# Altium schematic sheet TopLevel.SchDoc: =project_title
size Tabloid; CompanyName: Luxonis Holding; Organization: Luxonis Holding; Address1: 1925 Harmony Park Drive; Address2: Westminster, CO; Address3: 80234; Address4: United States; SheetNumber: 1; SheetTotal: 13
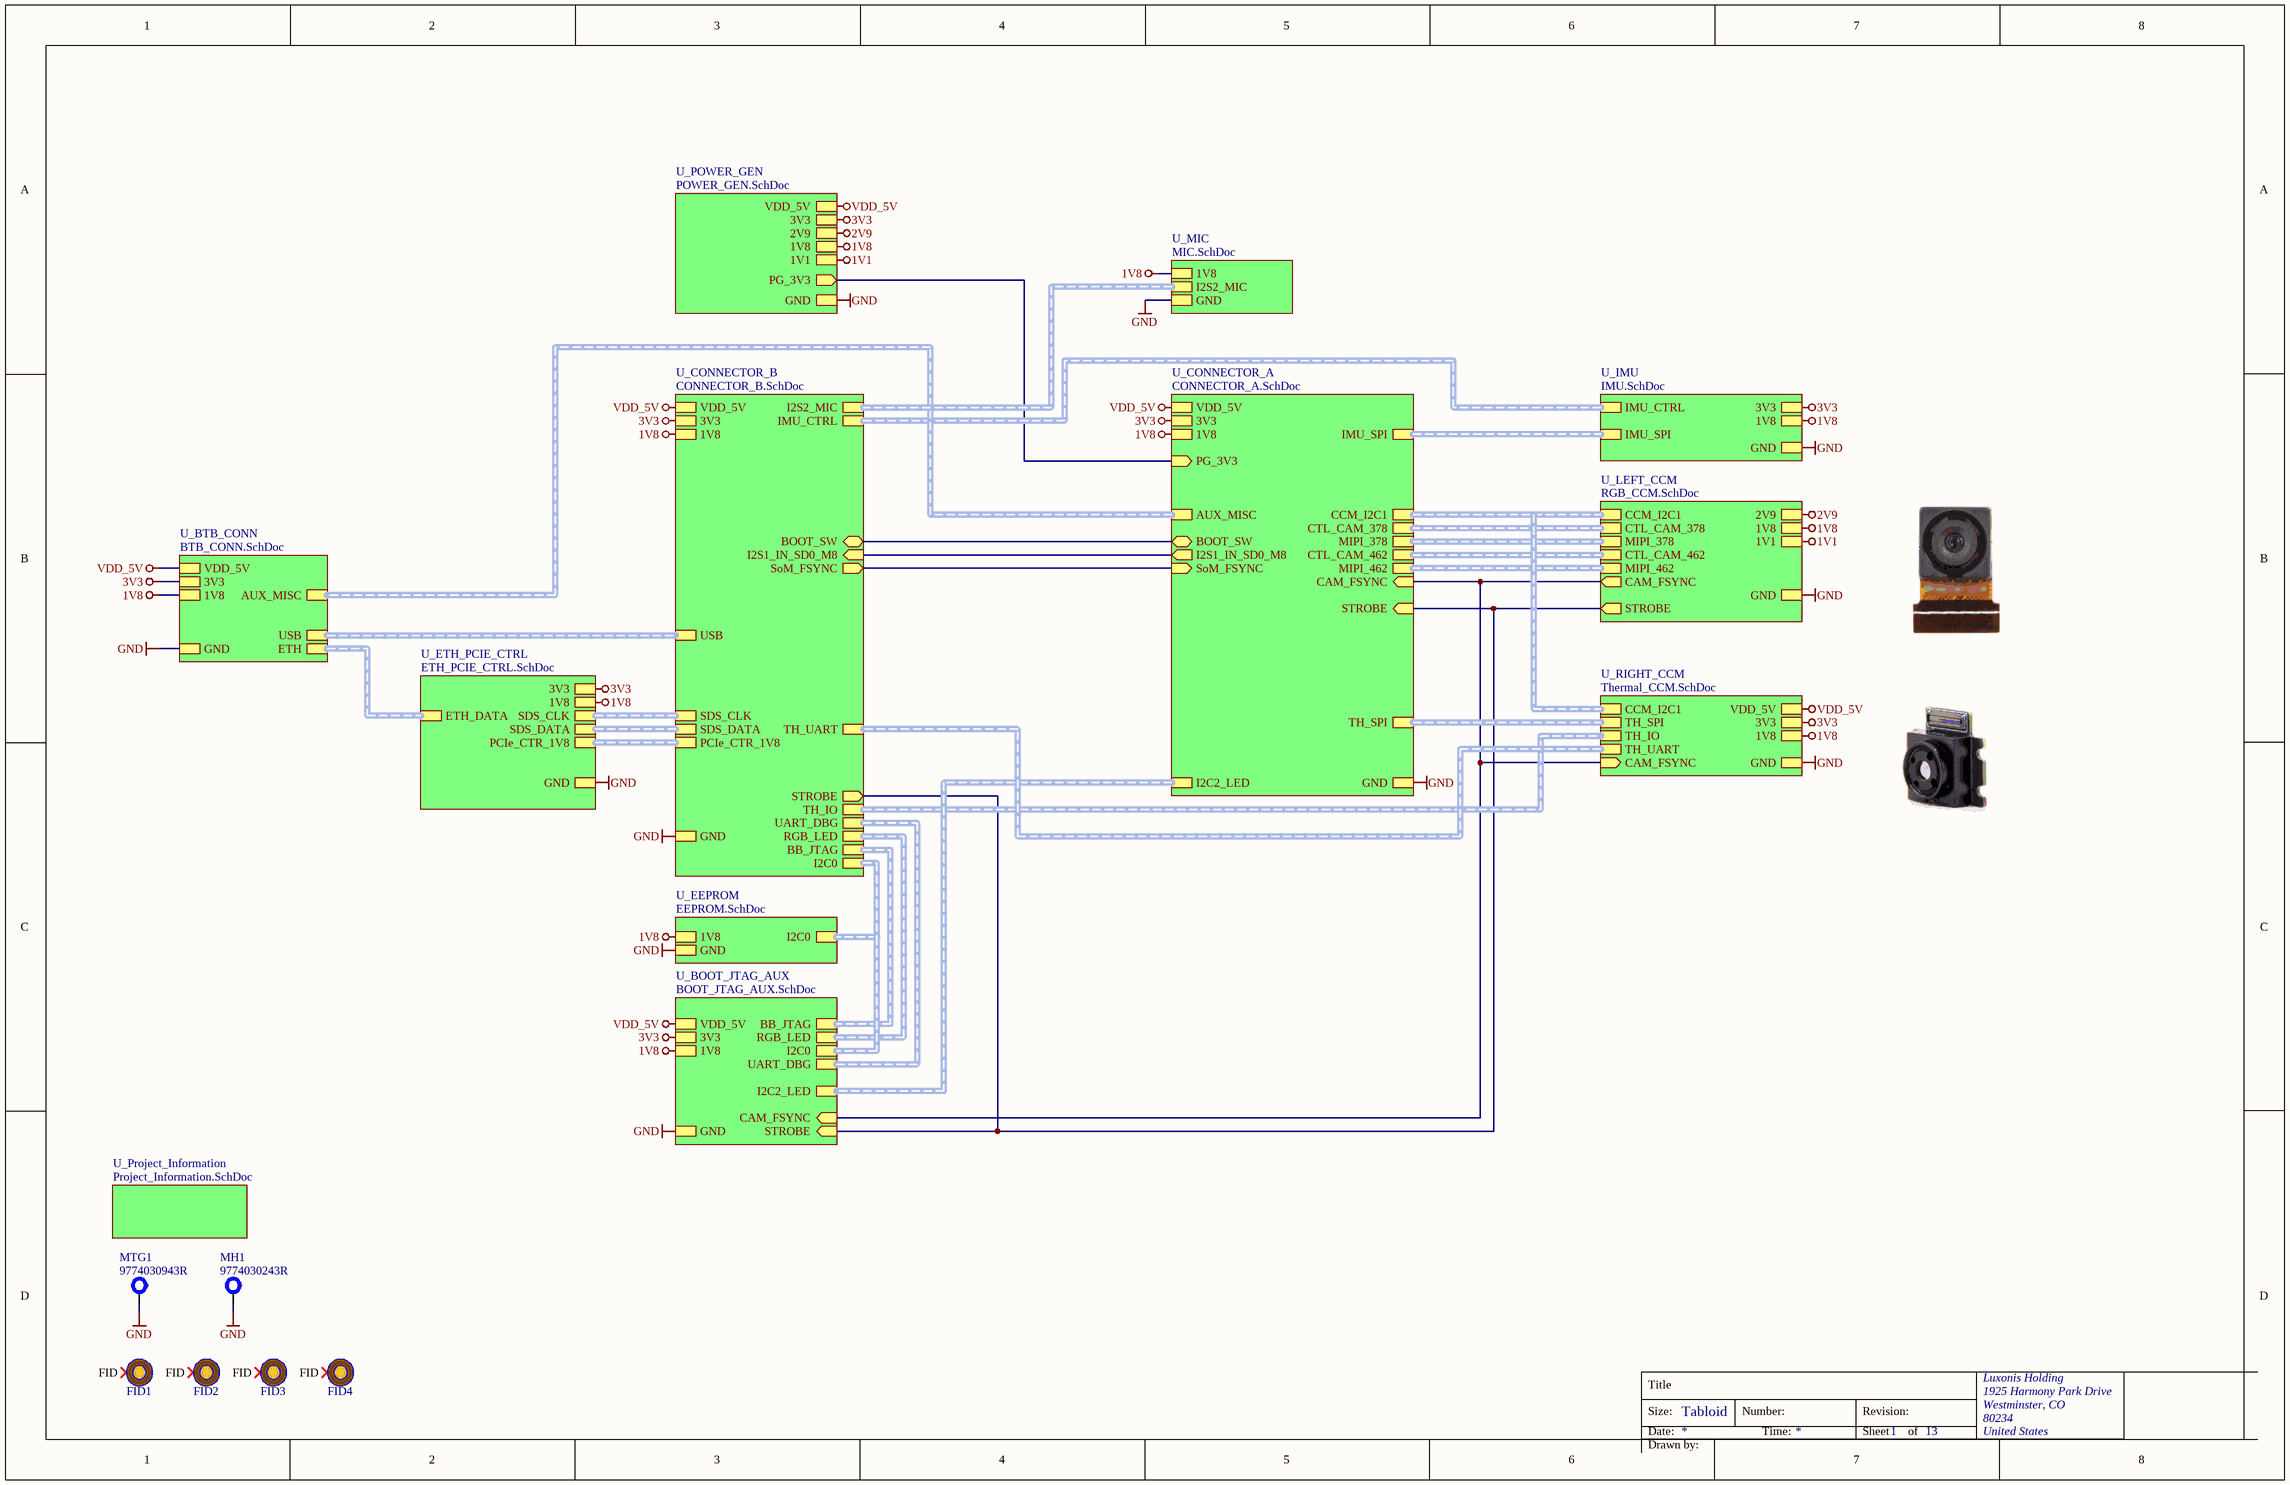
[diagram p0: TopLevel.SchDoc]

## Parts
FID1  FIDUCIAL  [FIDUCIAL_ROUND_1MM]  (value not drawn)  (no BOM)
FID2  FIDUCIAL  [FIDUCIAL_ROUND_1MM]  (value not drawn)  (no BOM)
FID3  FIDUCIAL  [FIDUCIAL_ROUND_1MM]  (value not drawn)  (no BOM)
FID4  FIDUCIAL  [FIDUCIAL_ROUND_1MM]  (value not drawn)  (no BOM)
MH1  9774030243R  [9774030243R]
MTG1  9774030943R  [9774030943R]

## Sub-sheets
U_BOOT_JTAG_AUX = BOOT_JTAG_AUX.SchDoc: RGB_LED (harness RGB_LED), BB_JTAG (harness BB_JTAG), 1V8, 3V3, VDD_5V, STROBE (in), GND, I2C0 (harness I2C0), UART_DBG (harness UART_DEBUG), CAM_FSYNC (in), I2C2_LED (harness I2C2)
U_BTB_CONN = BTB_CONN.SchDoc: GND, VDD_5V, 3V3, USB (harness USB), 1V8, AUX_MISC (harness AUX_MISC), ETH (harness ETH_DATA)
U_CONNECTOR_A = CONNECTOR_A.SchDoc: GND, PG_3V3 (in), 3V3, 1V8, VDD_5V, MIPI_462 (harness MIPI_462), AUX_MISC (harness AUX_MISC), BOOT_SW (bidir), STROBE (in), CAM_FSYNC (in), IMU_SPI (harness IMU_SPI), TH_SPI (harness TH_SPI), CCM_I2C1 (harness I2C1), CTL_CAM_378 (harness CTL_CAM_378), MIPI_378 (harness MIPI_378), CTL_CAM_462 (harness CTL_CAM_462), I2S1_IN_SD0_M8 (out), I2C2_LED (harness I2C2), SoM_FSYNC (in)
U_CONNECTOR_B = CONNECTOR_B.SchDoc: VDD_5V, RGB_LED (harness RGB_LED), 1V8, GND, 3V3, I2C0 (harness I2C0), BB_JTAG (harness BB_JTAG), USB (harness USB), BOOT_SW (bidir), UART_DBG (harness UART_DEBUG), IMU_CTRL (harness IMU_CTRL), SDS_CLK (harness SDS_CLK), SDS_DATA (harness SDS_DATA), PCIe_CTR_1V8 (harness PCIe_CTR_1V8), I2S1_IN_SD0_M8 (in), TH_IO (harness TH_IO), STROBE (out), TH_UART (harness UART), I2S2_MIC (harness I2S2_MIC), SoM_FSYNC (out)
U_EEPROM = EEPROM.SchDoc: 1V8, GND, I2C0 (harness I2C0)
U_ETH_PCIE_CTRL = ETH_PCIE_CTRL.SchDoc: 3V3, GND, ETH_DATA (harness ETH_DATA), SDS_DATA (harness SDS_DATA), SDS_CLK (harness SDS_CLK), PCIe_CTR_1V8 (harness PCIe_CTR_1V8), 1V8
U_IMU = IMU.SchDoc: 3V3, 1V8, GND, IMU_SPI (harness IMU_SPI), IMU_CTRL (harness IMU_CTRL)
U_LEFT_CCM = RGB_CCM.SchDoc: GND, 1V8, 1V1, MIPI_462 (harness MIPI_462), MIPI_378 (harness MIPI_378), 2V9, STROBE (out), CTL_CAM_378 (harness CTL_CAM_RGB), CTL_CAM_462 (harness CTL_CAM_RGB), CAM_FSYNC (out), CCM_I2C1 (harness I2C1)
U_MIC = MIC.SchDoc: 1V8, GND, I2S2_MIC (harness I2S2_MIC)
U_POWER_GEN = POWER_GEN.SchDoc: GND, 3V3, 1V8, VDD_5V, 1V1, PG_3V3 (out), 2V9
U_Project_Information = Project_Information.SchDoc: no entries
U_RIGHT_CCM = Thermal_CCM.SchDoc: GND, 3V3, VDD_5V, 1V8, TH_SPI (harness TH_SPI), TH_IO (harness TH_IO), CCM_I2C1 (harness I2C1), TH_UART (harness UART), CAM_FSYNC (in)

## Nets
1V1: sheet U_POWER_GEN/1V1, sheet U_LEFT_CCM/1V1
1V8: sheet U_CONNECTOR_B/1V8, sheet U_CONNECTOR_A/1V8, sheet U_ETH_PCIE_CTRL/1V8, sheet U_BOOT_JTAG_AUX/1V8, sheet U_POWER_GEN/1V8, sheet U_RIGHT_CCM/1V8, sheet U_LEFT_CCM/1V8, sheet U_IMU/1V8, sheet U_EEPROM/1V8, sheet U_BTB_CONN/1V8, sheet U_MIC/1V8
2V9: sheet U_POWER_GEN/2V9, sheet U_LEFT_CCM/2V9
3V3: sheet U_CONNECTOR_B/3V3, sheet U_CONNECTOR_A/3V3, sheet U_ETH_PCIE_CTRL/3V3, sheet U_BOOT_JTAG_AUX/3V3, sheet U_POWER_GEN/3V3, sheet U_RIGHT_CCM/3V3, sheet U_IMU/3V3, sheet U_BTB_CONN/3V3
GND: MH1.1 MTG1.1 ; sheet U_CONNECTOR_B/GND, sheet U_CONNECTOR_A/GND, sheet U_ETH_PCIE_CTRL/GND, sheet U_BOOT_JTAG_AUX/GND, sheet U_POWER_GEN/GND, sheet U_RIGHT_CCM/GND, sheet U_LEFT_CCM/GND, sheet U_IMU/GND, sheet U_EEPROM/GND, sheet U_BTB_CONN/GND, sheet U_MIC/GND
VDD_5V: sheet U_CONNECTOR_B/VDD_5V, sheet U_CONNECTOR_A/VDD_5V, sheet U_BOOT_JTAG_AUX/VDD_5V, sheet U_POWER_GEN/VDD_5V, sheet U_RIGHT_CCM/VDD_5V, sheet U_BTB_CONN/VDD_5V
(unnamed): sheet U_CONNECTOR_B/BOOT_SW, sheet U_CONNECTOR_A/BOOT_SW
(unnamed): sheet U_CONNECTOR_B/I2S1_IN_SD0_M8, sheet U_CONNECTOR_A/I2S1_IN_SD0_M8
(unnamed): sheet U_CONNECTOR_B/STROBE, sheet U_CONNECTOR_A/STROBE, sheet U_BOOT_JTAG_AUX/STROBE, sheet U_LEFT_CCM/STROBE
(unnamed): sheet U_CONNECTOR_B/SoM_FSYNC, sheet U_CONNECTOR_A/SoM_FSYNC
(unnamed): sheet U_CONNECTOR_A/PG_3V3, sheet U_POWER_GEN/PG_3V3
(unnamed): sheet U_CONNECTOR_A/CAM_FSYNC, sheet U_BOOT_JTAG_AUX/CAM_FSYNC, sheet U_RIGHT_CCM/CAM_FSYNC, sheet U_LEFT_CCM/CAM_FSYNC

Not connected (* = marked no-connect by the designer): FID1 FID*; FID2 FID*; FID3 FID*; FID4 FID*

## Buses and harness runs
harness sheet U_BOOT_JTAG_AUX/BB_JTAG = sheet U_CONNECTOR_B/BB_JTAG
harness sheet U_BOOT_JTAG_AUX/I2C0 = sheet U_CONNECTOR_B/I2C0 = sheet U_EEPROM/I2C0
harness sheet U_BOOT_JTAG_AUX/I2C2_LED = sheet U_CONNECTOR_A/I2C2_LED
harness sheet U_BOOT_JTAG_AUX/RGB_LED = sheet U_CONNECTOR_B/RGB_LED
harness sheet U_BOOT_JTAG_AUX/UART_DBG = sheet U_CONNECTOR_B/UART_DBG
harness sheet U_BTB_CONN/AUX_MISC = sheet U_CONNECTOR_A/AUX_MISC
harness sheet U_BTB_CONN/ETH = sheet U_ETH_PCIE_CTRL/ETH_DATA
harness sheet U_BTB_CONN/USB = sheet U_CONNECTOR_B/USB
harness sheet U_CONNECTOR_A/CCM_I2C1 = sheet U_LEFT_CCM/CCM_I2C1 = sheet U_RIGHT_CCM/CCM_I2C1
harness sheet U_CONNECTOR_A/CTL_CAM_378 = sheet U_LEFT_CCM/CTL_CAM_378
harness sheet U_CONNECTOR_A/CTL_CAM_462 = sheet U_LEFT_CCM/CTL_CAM_462
harness sheet U_CONNECTOR_A/IMU_SPI = sheet U_IMU/IMU_SPI
harness sheet U_CONNECTOR_A/MIPI_378 = sheet U_LEFT_CCM/MIPI_378
harness sheet U_CONNECTOR_A/MIPI_462 = sheet U_LEFT_CCM/MIPI_462
harness sheet U_CONNECTOR_A/TH_SPI = sheet U_RIGHT_CCM/TH_SPI
harness sheet U_CONNECTOR_B/I2S2_MIC = sheet U_MIC/I2S2_MIC
harness sheet U_CONNECTOR_B/IMU_CTRL = sheet U_IMU/IMU_CTRL
harness sheet U_CONNECTOR_B/PCIe_CTR_1V8 = sheet U_ETH_PCIE_CTRL/PCIe_CTR_1V8
harness sheet U_CONNECTOR_B/SDS_CLK = sheet U_ETH_PCIE_CTRL/SDS_CLK
harness sheet U_CONNECTOR_B/SDS_DATA = sheet U_ETH_PCIE_CTRL/SDS_DATA
harness sheet U_CONNECTOR_B/TH_IO = sheet U_RIGHT_CCM/TH_IO
harness sheet U_CONNECTOR_B/TH_UART = sheet U_RIGHT_CCM/TH_UART

## Notes on the sheet
- Title
- Size:
- Date:
- Tabloid
- Number:
- Time:
- Revision:
- Sheet
- of
- Drawn by:

## Library data of the parts
FID1-FID4 = CMP-011-000000-4: Fiducial with various available footprints; Manufacturer Part Number 1: /
MH1 = CMP-014-000015-1: MP ROUND STANDOFF M2X0.4 STEEL 3MM; Manufacturer 1: Wurth Electronics; Plating: Tin; Outside Diameter: 0.171inch; Threaded/Unthreaded: Threaded; RoHS: Yes; Pricing 1: 1=0.95000, 10=0.91800, 50=0.79500, 100=0.73900 (USD); ComponentLink1URL: http://www.mouser.com/ds/2/445/9774030243R-611455.pdf?src-supplier=Mouser; ComponentLink1Description: http://www.mouser.com/ds/2/445/9774030243R-611455.pdf?src-supplier=Mouser; Material: Steel; REACH SVHC: Unknown; Length: 0.173inch; ComponentLink4Description: http://www.farnell.com/datasheets/1960368.pdf?src-supplier=Newark; ComponentLink3Description: https://katalog.we-online.de/em/datasheet/9774030243R.pdf?src-supplier=Digi-Key; Stock 1: 20568; ComponentLink5URL: http://www.farnell.com/datasheets/1960368.pdf?src-supplier=Element14; ComponentLink3URL: https://katalog.we-online.de/em/datasheet/9774030243R.pdf?src-supplier=Digi-Key; ComponentLink2Description: http://www.farnell.com/datasheets/1960368.pdf?src-supplier=Farnell; ComponentLink4URL: http://www.farnell.com/datasheets/1960368.pdf?src-supplier=Newark; Source: LuxonisMaster.SchLib; Manufacturer Part Number 1: 9774030243R; Design Item ID: 9774030243R; ComponentLink2URL: http://www.farnell.com/datasheets/1960368.pdf?src-supplier=Farnell; ComponentLink5Description: http://www.farnell.com/datasheets/1960368.pdf?src-supplier=Element14
MTG1 = CMP-090-000000-4: Spacers/Standoffs; Manufacturer 1: Wurth Electronics; Manufacturer Part Number 1: 9774030943R